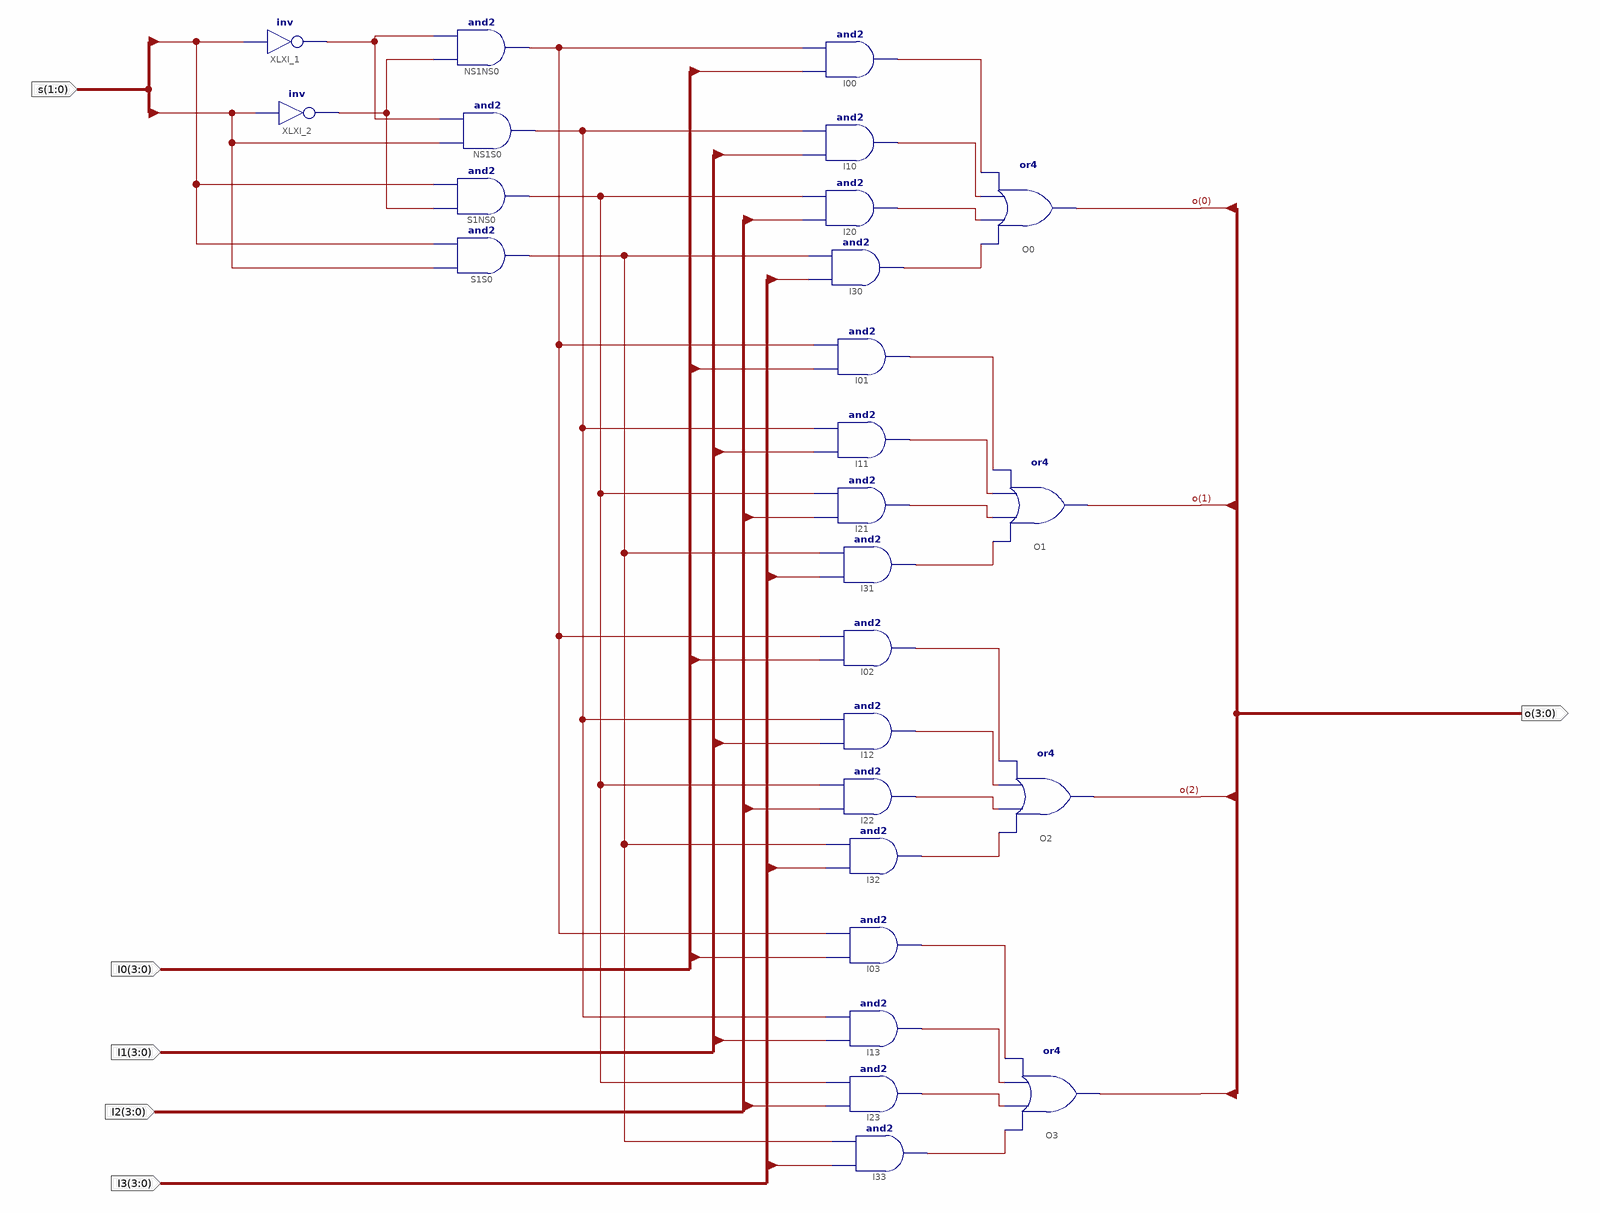
[diagram p0: schematic sheet 1]
// Xilinx ISE schematic MUX441.sch (kintex7) as structural Verilog: 26 symbols, 6 ports
module MUX441 (
  input  [1:0] s,
  input  [3:0] I0,
  input  [3:0] I1,
  input  [3:0] I2,
  input  [3:0] I3,
  output [3:0] o
);

  wire NS0, NS1, XLXN_20, XLXN_21, XLXN_22, XLXN_23, XLXN_126, XLXN_127, XLXN_128, XLXN_129, XLXN_131,
       XLXN_132, XLXN_133, XLXN_134, XLXN_135, XLXN_136, XLXN_137, XLXN_138, XLXN_139, XLXN_142, XLXN_145,
       XLXN_148;

  not XLXI_1 (NS1, s[1]);
  and NS1NS0 (XLXN_139, NS0, NS1);
  and NS1S0 (XLXN_142, s[0], NS1);
  and S1NS0 (XLXN_145, NS0, s[1]);
  not XLXI_2 (NS0, s[0]);
  and I00 (XLXN_20, I0[0], XLXN_139);
  and I10 (XLXN_21, I1[0], XLXN_142);
  and I20 (XLXN_22, I2[0], XLXN_145);
  and I30 (XLXN_23, I3[0], XLXN_148);
  or O0 (o[0], XLXN_23, XLXN_22, XLXN_21, XLXN_20);
  and S1S0 (XLXN_148, s[0], s[1]);
  and I01 (XLXN_126, I0[1], XLXN_139);
  or O1 (o[1], XLXN_129, XLXN_128, XLXN_127, XLXN_126);
  and I11 (XLXN_127, I1[1], XLXN_142);
  and I21 (XLXN_128, I2[1], XLXN_145);
  and I31 (XLXN_129, I3[1], XLXN_148);
  and I02 (XLXN_131, I0[2], XLXN_139);
  or O2 (o[2], XLXN_134, XLXN_133, XLXN_132, XLXN_131);
  and I12 (XLXN_132, I1[2], XLXN_142);
  and I22 (XLXN_133, I2[2], XLXN_145);
  and I32 (XLXN_134, I3[2], XLXN_148);
  and I03 (XLXN_135, I0[3], XLXN_139);
  or O3 (o[3], XLXN_138, XLXN_137, XLXN_136, XLXN_135);
  and I13 (XLXN_136, I1[3], XLXN_142);
  and I23 (XLXN_137, I2[3], XLXN_145);
  and I33 (XLXN_138, I3[3], XLXN_148);
endmodule
